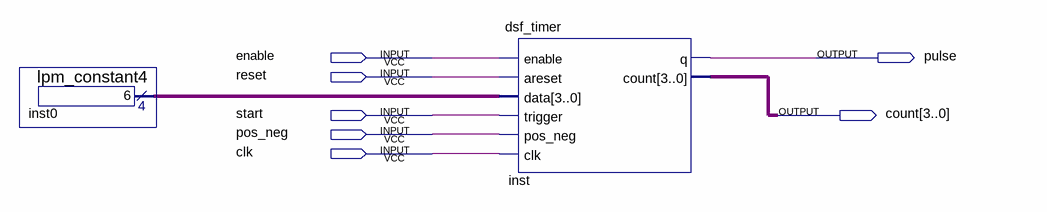
[diagram p0: schematic sheet]
// Quartus schematic bloco1.bdf as structural Verilog: 2 symbols, 7 pins
module bloco1 (
  input  enable,
  input  reset,
  input  start,
  input  pos_neg,
  input  clk,
  output pulse,
  output [3:0] count
);

  wire [3:0] inst0_result;

  lpm_constant4 inst0 (.result(inst0_result));
  dsf_timer inst (
    .enable(enable), .areset(reset), .data(inst0_result), .trigger(start), .pos_neg(pos_neg), .clk(clk),
    .q(pulse), .count(count));
endmodule
